# EAGLE schematic IR_BLASTER_MINI (EAGLE 9.6.2)
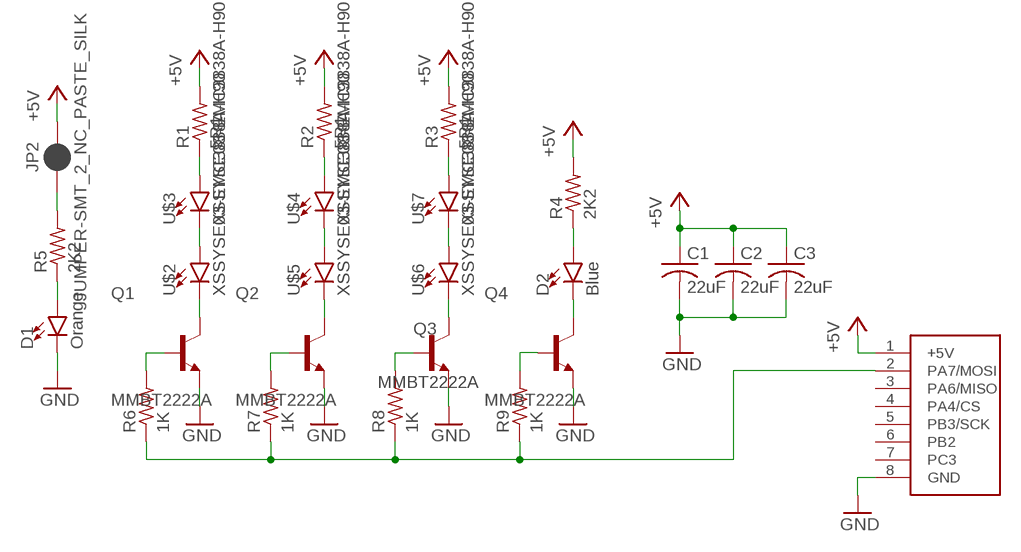
[diagram p0: schematic, sheet 1]

## Parts
C1  22uF  C-USC3216  [C3216]
C2  22uF  C-USC3216  [C3216]
C3  22uF  C-USC3216  [C3216]
D1  Orange  LED-GREEN0603  [LED-0603]
D2  Blue  LED-BLUE0603  [LED-0603]
JP2  JUMPER-SMT_2_NC_PASTE_SILK  [SMT-JUMPER_2_NC_PASTE_SILK]
Q1  MMBT2222A  [SOT95P240X120-3N]
Q2  MMBT2222A  [SOT95P240X120-3N]
Q3  MMBT2222A  [SOT95P240X120-3N]
Q4  MMBT2222A  [SOT95P240X120-3N]
R1  5R1  R-US_R2512  [R2512]
R2  5R1  R-US_R2512  [R2512]
R3  5R1  R-US_R2512  [R2512]
R4  2K2  R-US_R0603  [R0603]
R5  2K2  R-US_R0603  [R0603]
R6  1K  R-US_R0603  [R0603]
R7  1K  R-US_R0603  [R0603]
R8  1K  R-US_R0603  [R0603]
R9  1K  R-US_R0603  [R0603]
U$1  LEFT-H1-SMD  [LEFT-H1-SMD]
U$2  XSSYSE03-EMC3838A-H90  [XSSYSE03-EMC3838A-H90]
U$3  XSSYSE03-EMC3838A-H90  [XSSYSE03-EMC3838A-H90]
U$4  XSSYSE03-EMC3838A-H90  [XSSYSE03-EMC3838A-H90]
U$5  XSSYSE03-EMC3838A-H90  [XSSYSE03-EMC3838A-H90]
U$6  XSSYSE03-EMC3838A-H90  [XSSYSE03-EMC3838A-H90]
U$7  XSSYSE03-EMC3838A-H90  [XSSYSE03-EMC3838A-H90]

## Nets
+5V: C1.1 C2.1 C3.1 JP2.2 R1.2 R2.2 R3.2 R4.2 U$1.1(+5V)
GND: C1.2 C2.2 C3.2 D1.C Q1.2(E) Q2.2(E) Q3.2(E) Q4.2(E) U$1.8(GND)
N$1: D1.A R5.1
N$2: Q1.1(B) R6.2
N$3: Q1.3(C) U$2.P$2(C)
N$4: U$2.P$1(A) U$3.P$2(C)
N$5: R1.1 U$3.P$1(A)
N$6: R2.1 U$4.P$1(A)
N$7: U$4.P$2(C) U$5.P$1(A)
N$8: Q2.3(C) U$5.P$2(C)
N$9: Q2.1(B) R7.2
N$10: Q3.1(B) R8.2
N$11: Q3.3(C) U$6.P$2(C)
N$12: U$6.P$1(A) U$7.P$2(C)
N$13: R3.1 U$7.P$1(A)
N$14: D2.A R4.1
N$15: D2.C Q4.3(C)
N$16: Q4.1(B) R9.2
N$17: JP2.1 R5.2
N$19: R6.1 R7.1 R8.1 R9.1 U$1.2(PA7/MOSI)
Unconnected: U$1.3(PA6/MISO) U$1.4(PA4/CS) U$1.5(PB3/SCK) U$1.6(PB2) U$1.7(PC3)

## Library data of the parts
C1-C3 = rcl:C-US: CAPACITOR, American symbol; SPICEPREFIX: C
D1 = SparkFun-LED:LED-GREEN: Green SMD LED Used in manufacturing of various products at SparkFun Packages: 0603 - SMD 0603 package [Product Link] <http://www.futureelectronics.com/en/technologies/semiconductors/optoelectronics/leds/Pages/9894312-LTST-C190GKT.aspx?CrossPart=HSMG-C190&IM=0> LilyPad 1206 - SMD1206 LilyPad package [Product Link] <http://www.futureelectronics.com/en/Technologies/Product.aspx?ProductID=IN150NGHARVATEKCORPORATION2049943&IM=0> 1206 - SMD1206 package [Product Link] <http://www.futureelectronics.com/en/technologies/semiconductors/optoelectronics/leds/Pages/8315665-LTST-C150KGKT.aspx?IM=0> 1206 Bottom Mount -SMD 1206 Bottom Mount [Product Link] <http://www.digikey.com/product-detail/en/lite-on-inc/LTST-C230KGKT/160-1456-1-ND/386854> SparkFun Products: Pro Mini 328 -5V <https://www.sparkfun.com/products/821> RedBoard <https://www.sparkfun.com/products/12757> MP3 Trigger <https://www.sparkfun.com/products/13720> Makey Makey <https://www.sparkfun.com/products/11076>; PROD_ID: DIO-00821; VALUE: Green
D2 = SparkFun-LED:LED-BLUE: Blue SMD LED Used in manufacturing of various products at SparkFun Packages: 0603 - SMD 0603 package [Product Link] <http://www.digikey.com/product-detail/en/SMLE12BC7TT86/511-1589-2-ND/1641808> 1206 - SMD1206 package [Product Link] <http://www.digikey.com/product-detail/en/lite-on-inc/LTST-C150TBKT/160-1643-1-ND/573584> SparkFun Products: ESP8266 Thing-Dev Board <https://www.sparkfun.com/products/13711> RedBoard <https://www.sparkfun.com/products/12757>; PROD_ID: DIO-08575
JP2 = SparkFun-Jumpers:JUMPER-SMT_2_NC_PASTE: Normally closed solder jumper This jumper has an aperture in the stencil to allow solder paste to bridge the split in the wire so it's normally closed (NC). Wick off the solder to open the connection. Reapply solder to reclose the connection.
Q1-Q4 = MMBT2222A:MMBT2222A; MANUFACTURER: Diotec; MAXIMUM_PACKAGE_HEIGHT: 1.20mm; PARTREV: 2024-03-11; SNAPEDA_PACKAGE_ID: 124619; STANDARD: IPC 7351B
R1-R9 = rcl:R-US_: RESISTOR, American symbol; SPICEPREFIX: R
U$1 = Flipper-Zero-GPIO-Headers:LEFT-H1-SMD
U$2-U$7 = XSSY SE03-EMC3838A-H90:XSSYSE03-EMC3838A-H90